# EAGLE design HIZ12 (EAGLE 7.3.0)
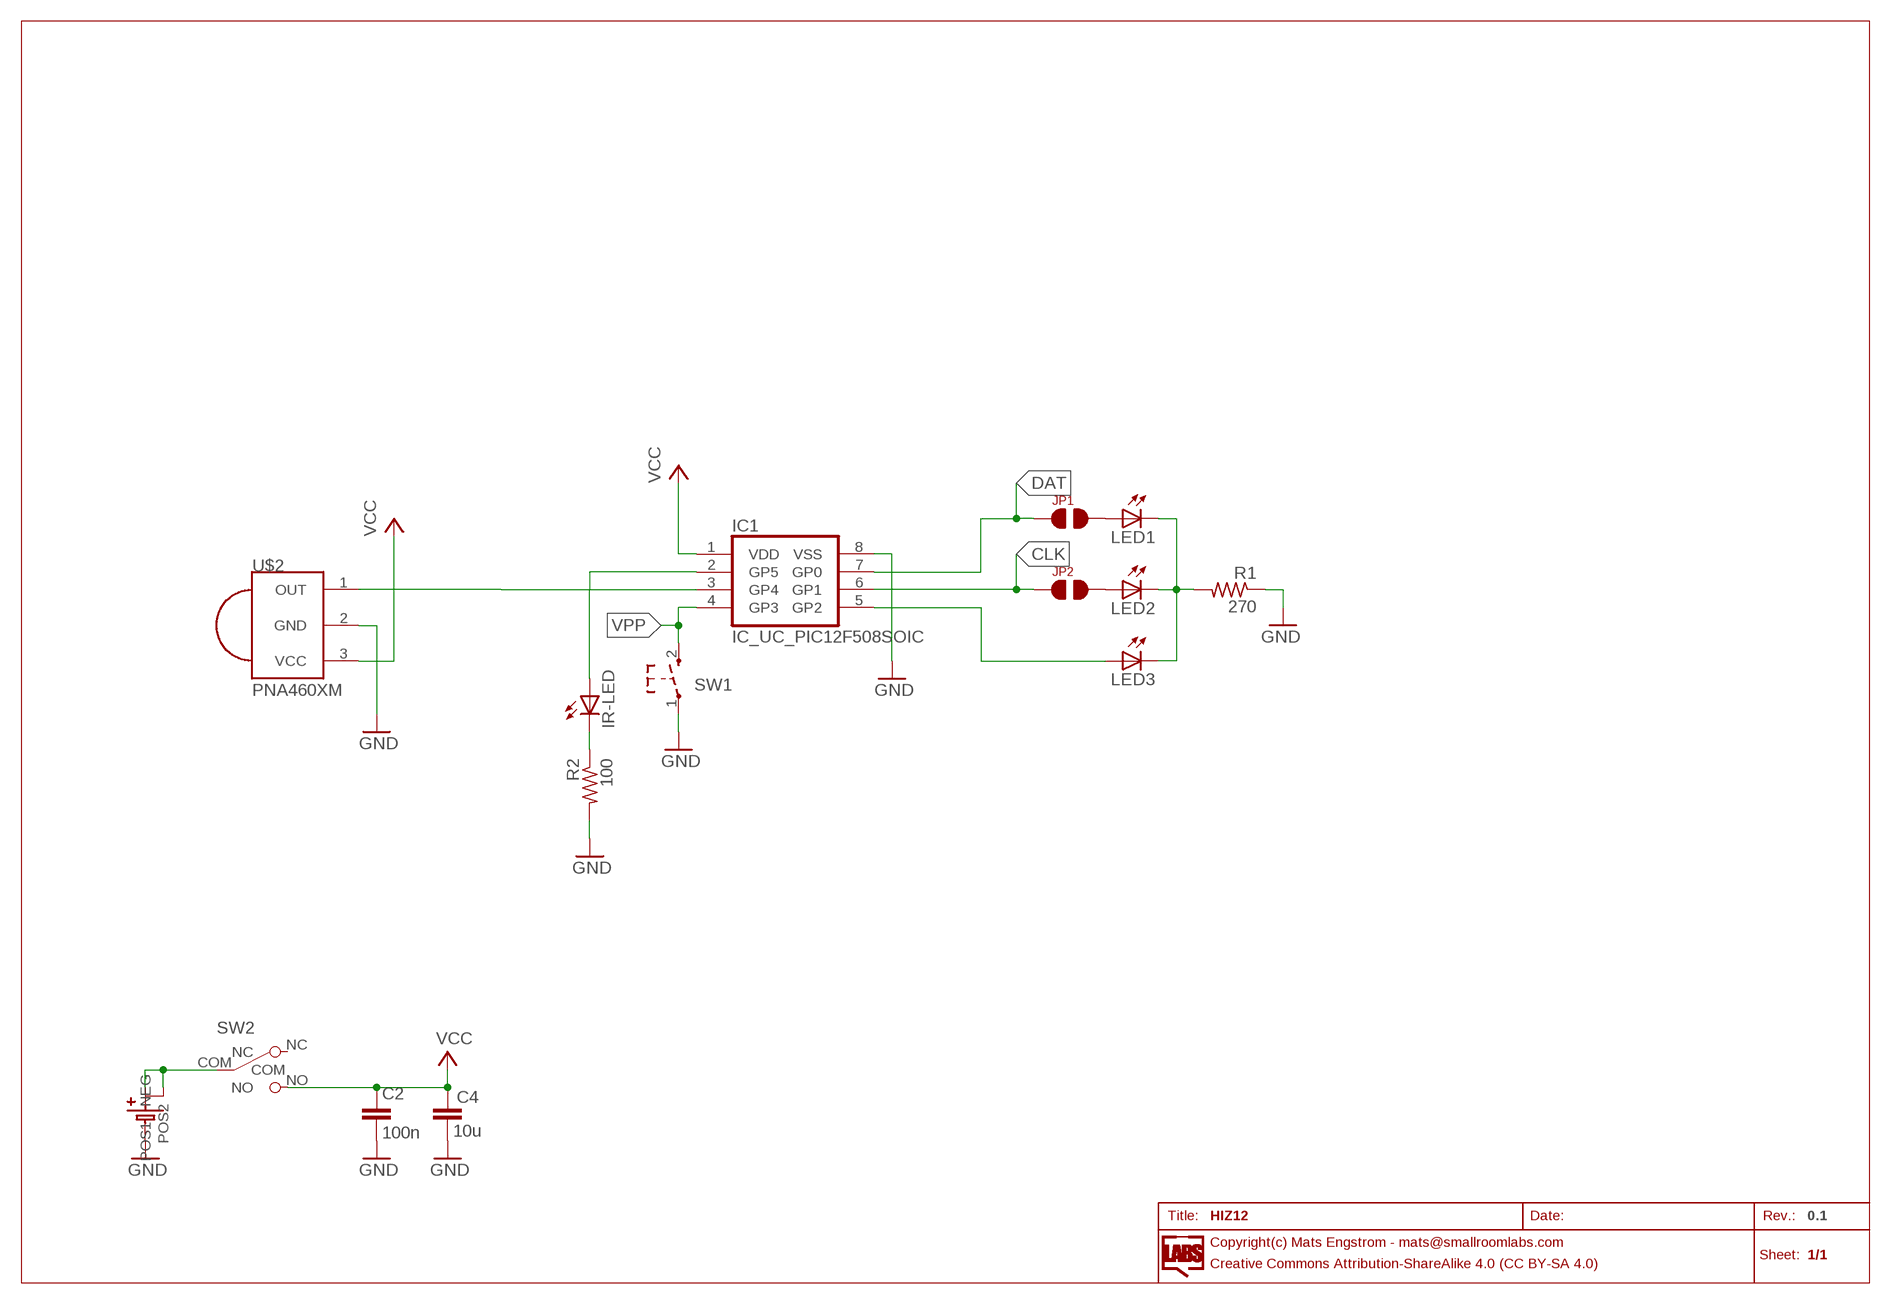
[diagram p0: schematic, sheet 1]

## Parts
C2  100n  CAPACITOR_NPOL-0805  [C805]
C4  10u  CAPACITOR_NPOL-0805  [C805]
IC1  IC_UC_PIC12F508SOIC  [SO-8]
IR-LED  LEDSMT1206  [1206]
JP1  JP2-TINY  [JP2-T]
JP2  JP2-TINY  [JP2-T]
LED1  LED-0805  [LED-805]
LED2  LED-0805  [LED-805]
LED3  LED-0805  [LED-805]
R1  270  R-0805  [R0805]
R2  100  R-0805  [R0805]
SW1  SW_TACT_2P-3X6  [SW_TACT_3X6]
SW2  SW_SLIDE  [SLIDE_SWITCH_SMD]
U$2  PNA460XM  [PNA460XM]
U$3  BATTERYCOIN-12MM-SMD  [CR1220-SMD]

## Nets
CLK: IC1.6(GP1) JP2.P$1
DAT: IC1.7(GP0) JP1.P$1
GND: C2.2 C4.2 IC1.8(VSS) R1.1 R2.2 SW1.1 U$2.2(GND) U$3.-(NEG)
N$1: LED1.C LED2.C LED3.C R1.2
N$2: JP1.P$2 LED1.A
N$3: JP2.P$2 LED2.A
N$4: IC1.5(GP2) LED3.A
N$5: SW2.COM U$3.+$1(POS1) U$3.+$2(POS2)
N$6: IC1.3(GP4) U$2.1(OUT)
N$7: IR-LED.C R2.1
N$8: IC1.2(GP5) IR-LED.A
VCC: C2.1 C4.1 IC1.1(VDD) SW2.NO U$2.3(VCC)
VPP: IC1.4(GP3) SW1.2
Unconnected: SW2.NC

## Library data of the parts
C2 C4 = dp_devices:CAPACITOR_NPOL: Non-Polarized capacitor in various packages
IC1 = dp_devices:IC_UC_PIC12F508
IR-LED = adafruit:LED: LED OSRAM: - CHIPLED LG R971, LG N971, LY N971, LG Q971, LY Q971, LO R971, LY R971 LH N974, LH R974 LS Q976, LO Q976, LY Q976 LO Q996 - Hyper CHIPLED LW Q18S LB Q993, LB Q99A, LB R99A - SideLED LS A670, LO A670, LY A670, LG A670, LP A670 LB A673, LV A673, LT A673, LW A673 LH A674 LY A675 LS A676, LA A676, LO A676, LY A676, LW A676 LS A679, LY A679, LG A679 - Hyper Micro SIDELED® LS Y876, LA Y876, LO Y876, LY Y876 LT Y87S - SmartLED LW L88C, LW L88S LB L89C, LB L89S, LG L890 LS L89K, LO L89K, LY L89K LS L896, LA L896, LO L896, LY L896 - TOPLED LS T670, LO T670, LY T670, LG T670, LP T670 LSG T670, LSP T670, LSY T670, LOP T670, LYG T670 LG T671, LOG T671, LSG T671 LB T673, LV T673, LT T673, LW T673 LH T674 LS T676, LA T676, LO T676, LY T676, LB T676, LH T676, LSB T676, LW T676 LB T67C, LV T67C, LT T67C, LS T67K, LO T67K, LY T67K, LW E67C LS E67B, LA E67B, LO E67B, LY E67B, LB E67C, LV E67C, LT E67C LW T67C LS T679, LY T679, LG T679 LS T770, LO T770, LY T770, LG T770, LP T770 LB T773, LV T773, LT T773, LW T773 LH T774 LS E675, LA E675, LY E675, LS T675 LS T776, LA T776, LO T776, LY T776, LB T776 LHGB T686 LT T68C, LB T68C - Hyper Mini TOPLED® LB M676 - Mini TOPLED Santana® LG M470 LS M47K, LO M47K, LY M47K Source: http://www.osram.convergy.de/
JP1 JP2 = SmallRoomLabs_ConSwitch:JP2
LED1-LED3 = dp_devices:LED: Light Emitting Diode
R1 R2 = SmallRoomLabs_Discrete:R
SW1 = dp_devices:SW_TACT_2P
SW2 = dp_devices:SW_SLIDE
U$2 = adafruit:PNA460XM: IR 38KHz receiver PNA4602 and related receivers http://www.ladyada.net/library/pcb/eaglelibrary.html
U$3 = SmallRoomLabs:BATTERY

## Net classes
0 default: width 0.203 mm, drill 0.305 mm, clearance 0.203 mm

## Board
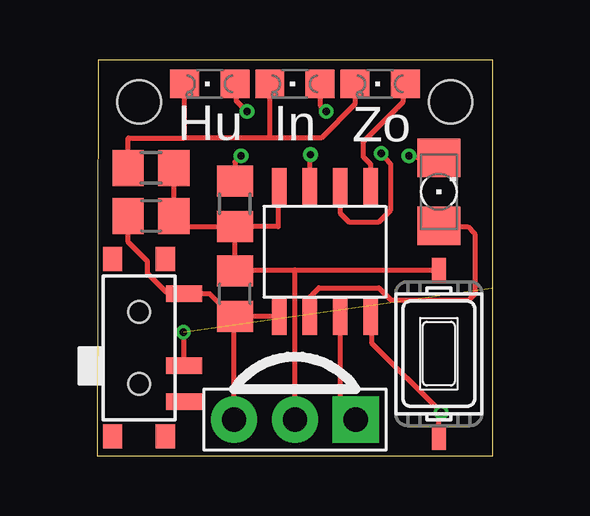
[diagram p1: board, top side]
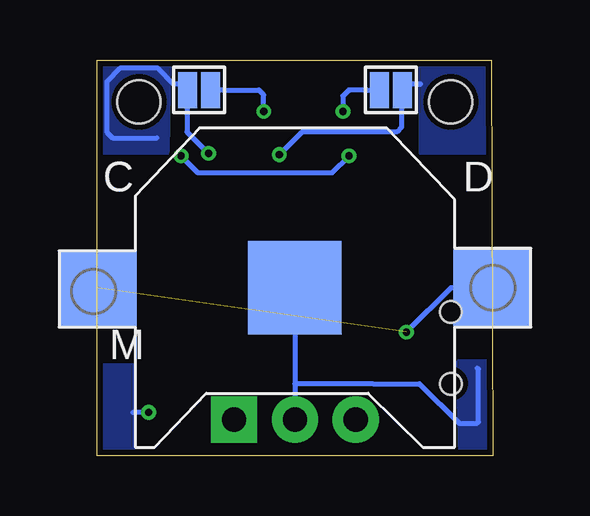
[diagram p2: board, bottom side, seen from below]

Size 16.5 x 16.5 mm. Coordinates in mm from the lower left corner, seen from the top.
Outline: 0,0 16.5,0 16.5,16.5 0.05,16.5 0,0
Copper layers (1*16): Top 0.035mm / dielectric 1.5mm / Bottom 0.035mm
Design rules "dirt_cheap_dirty_boards.v1": minimum track width 5mil, minimum drill 12mil, track to track 5mil, track to pad 5mil, pad to pad 5mil, via to via 5mil, smd to smd 0mil, copper to edge 10mil, drill to drill 10mil, minimum pad ring 10mil, minimum via ring 6mil, stop-mask expansion 2mil, vias tented up to drill 25mil, thermal gap 10mil
Holes 1.8 mm at 1.75,14.75 14.75,14.75

### Footprints (pad centres in the part's own frame; a part is rotated, then mirrored left to right if it is on the bottom)
C805 = smd 1.3 x 1.5: 1 -0.95,0; 2 0.95,0
SO-8 = smd 0.6 x 1.55: 1 -1.905,-2.69; 2 -0.635,-2.69; 3 0.635,-2.69; 4 1.905,-2.69; 5 1.905,2.71; 6 0.635,2.71; 7 -0.635,2.71; 8 -1.905,2.71
1206 = smd 1.6 x 1.803: A -1.422,0; C 1.422,0
JP2-T = smd 0.8 x 1.5: P$1 -0.483,0; P$2 0.483,0
LED-805 = smd 1.2 x 1.2: A 0,-1.05; C 0,1.05
R0805 = smd 1.3 x 1.5: 1 -0.95,0; 2 0.95,0
SW_TACT_3X6 = smd 1 x 0.6: 1 -3.5,0; 2 3.5,0
SLIDE_SWITCH_SMD = smd 0.7 x 1.5: COM 0.75,1.875; NC 2.25,1.875; NO -2.25,1.875 | smd 1 x 0.8: P$1 -3.7,-1.1; P$2 -3.7,1.1; P$3 3.7,1.1; P$4 3.7,-1.1 | hole 0.9: -1.5,0; 1.5,0
PNA460XM = drill 1.016 pad 1.93 square: 1 -2.54,0 | drill 1.016 pad 1.93: 2 0,0; 3 2.54,0
CR1220-SMD = smd 3.2 x 3.2: +$1 -8.2,0; +$2 8.2,0 | smd 3.9 x 3.9: - 0,0

### Placement (x,y rotation side)
C2  5.75,6.75 90 top
C4  2.25,10 0 top
IC1  9.5,8.5 0 top
IR-LED  14.25,11 90 top
JP1  4.25,15.25 180 bottom
JP2  12.25,15.25 0 bottom
LED1  4.7,15.5 90 top
LED2  8.25,15.5 90 top
LED3  11.8,15.5 90 top
R1  2.25,12 180 top
R2  5.75,10.5 270 top
SW1  14.25,4.25 270 top
SW2  1.75,4.5 270 top
U$2  8.25,1.5 180 top
U$3  8.25,7 180 bottom

### Tracks (layer width: path | path; a pad name or v marks a point on that pad's centre or on a via)
CLK  (via drill 0.3)
  Top 0.203: IC1.6 10.13,10.12 10.5,9.75 11.75,9.75 12.25,10.25 12.25,12.15 v11.85,12.6
  Bottom 0.203: 12.75,15.5 JP2.P$1 | 12.75,15.5 12.75,14.25 12.75,13.5 v11.85,12.6 | 12.75,15.5 13.3,15.5 13.95,16.15 15.55,16.15 16.1,15.6 16.1,13.5 15.85,13.25 14,13.25
  pour Bottom: 13.5,16.5 16.5,16.5 16.55,12.65 13.55,12.65
DAT  (via drill 0.3)
  Top 0.203: 8.85,11.25 IC1.7 8.87,11.23 v8.9,12.55
  Bottom 0.203: 3,15.5 3.1,15.5 3.75,15.5 JP1.P$1 3.8,15.4 3.8,13.7 4,13.5 7.95,13.5 v8.9,12.55
  pour Bottom: 0,16.5 3,16.5 3,12.65 0,12.65
GND
  Top 0.203: R1.1 C4.2 3.3,10 3.3,9.55 R2.2 | 8.25,7.75 5.8,7.75 C2.2 5.75,7.8 R2.2 | 8.25,7.75 SW1.1 | IC1.8 7.55,11.2 7.55,9.55 R2.2 | U$2.2 8.25,7.65 8.25,7.75
  Bottom 0.203: U$3.- 8.25,3 | 8.25,3 U$2.2 | 8.25,3 5,3 3.05,3 1.4,1.35 0.65,1.35 0.6,1.4 0.6,3.6 0.65,3.65
  pour Bottom: 0,0 0.1,3.9 1.45,3.9 1.35,0
N$1
  Top 0.203: 7.25,13.25 9.35,13.25 10.75,14.65 LED3.C | 7.25,13.25 3.65,13.25 | 3.65,13.25 LED1.C | R1.2 1.3,13.25 3.65,13.25 | LED2.C 7.2,13.3 7.25,13.25
N$2  (via drill 0.3)
  Top 0.203: LED1.A 5.8,14.8 v6.25,14.35
  Bottom 0.203: 4.75,15.5 JP1.P$2 5.25,15.25 6,15.25 6.25,15 v6.25,14.35
N$3  (via drill 0.3)
  Top 0.203: LED2.A 9.3,14.6 v9.55,14.35
  Bottom 0.203: JP2.P$2 11.25,15.25 9.75,15.25 9.55,15.05 v9.55,14.35
N$4
  Top 0.203: 11.45,11.25 IC1.5 11.4,12.15 11.1,12.45 11.1,13.1 12.5,14.5 12.75,14.75 12.75,15.45 LED3.A
N$5  (via drill 0.3)  (1 unrouted)
  Top 0.203: v3.6,5.15 3.6,3.78 SW2.COM
  Bottom 0.203: U$3.+$1 1.75,7 v3.6,5.15
N$6
  Top 0.203: IC1.3 10.15,5.8 10.15,2.1 10.75,1.5 U$2.1
N$7  (via drill 0.3)
  Top 0.203: 14.25,12.4 IR-LED.C 13.08,12.42 v13,12.5 | v6,12.5 5.75,12.25 R2.1
  Bottom 0.203: v13,12.5 12.3,11.8 6.7,11.8 v6,12.5
N$8
  Top 0.203: 8.9,6.1 8.9,5.85 IC1.2 8.87,6.62 9,6.75 9.25,7 11.75,7 12.25,6.5 15.5,6.5 15.75,6.75 15.75,9.25 15.45,9.55 14.25,9.55 IR-LED.A
VCC
  Top 0.203: C2.1 7.55,5.8 IC1.1 | C2.1 5.65,5.8 4.7,6.75 3.65,6.75 SW2.NO 3.55,6.8 2.9,6.8 2.1,7.6 2.1,8.1 1.3,8.9 C4.1 | U$2.3 5.7,5.7 C2.1
VPP  (via drill 0.3)
  Top 0.203: IC1.4 11.45,5.8 11.45,4.7 v14.35,1.8 14.25,1.7 SW1.2
  Bottom 0.203: v14.35,1.8 14.9,1.8 15,1.8
  pour Bottom: 15,0 15,3.75 16.5,3.75 16.5,0

### Text on the board
tPlace: Hu | In | Zo
bPlace: D | C | M